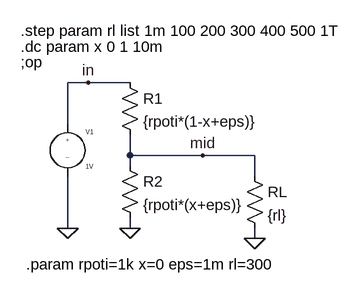
[diagram p0: schematic poti.asc]
poti.asc, the LTspice schematic file:
Version 4
SHEET 1 880 680
WIRE 144 96 112 96
WIRE 208 96 144 96
WIRE 112 160 112 96
WIRE 208 208 208 176
WIRE 320 208 208 208
WIRE 400 208 320 208
WIRE 208 224 208 208
WIRE 400 240 400 208
WIRE 112 320 112 240
WIRE 208 320 208 304
WIRE 400 336 400 320
FLAG 208 320 0
FLAG 112 320 0
FLAG 320 208 mid
FLAG 144 96 in
FLAG 400 336 0
SYMBOL res 192 80 R0
SYMATTR InstName R1
SYMATTR Value {rpoti*(1-x+eps)}
SYMBOL res 192 208 R0
SYMATTR InstName R2
SYMATTR Value {rpoti*(x+eps)}
SYMBOL source-V 112 144 R0
SYMATTR InstName V1
SYMATTR Value 1V
SYMBOL res 384 224 R0
SYMATTR InstName RL
SYMATTR Value {rl}
TEXT 48 376 Left 2 !.param rpoti=1k x=0 eps=1m rl=300
TEXT 40 64 Left 2 !;op
TEXT 40 40 Left 2 !.dc param x 0 1 10m
TEXT 40 16 Left 2 !.step param rl list 1m 100 200 300 400 500 1T

The netlist it stands for:
* poti.asc
R1 in mid {rpoti*(1-x+eps)}
R2 mid 0 {rpoti*(x+eps)}
V1 in 0 1V
RL mid 0 {rl}
.param rpoti=1k x=0 eps=1m rl=300
;op
.dc param x 0 1 10m
.step param rl list 1m 100 200 300 400 500 1T
.backanno
.end